# Altium schematic sheet connectors_and_power.SchDoc
size A4
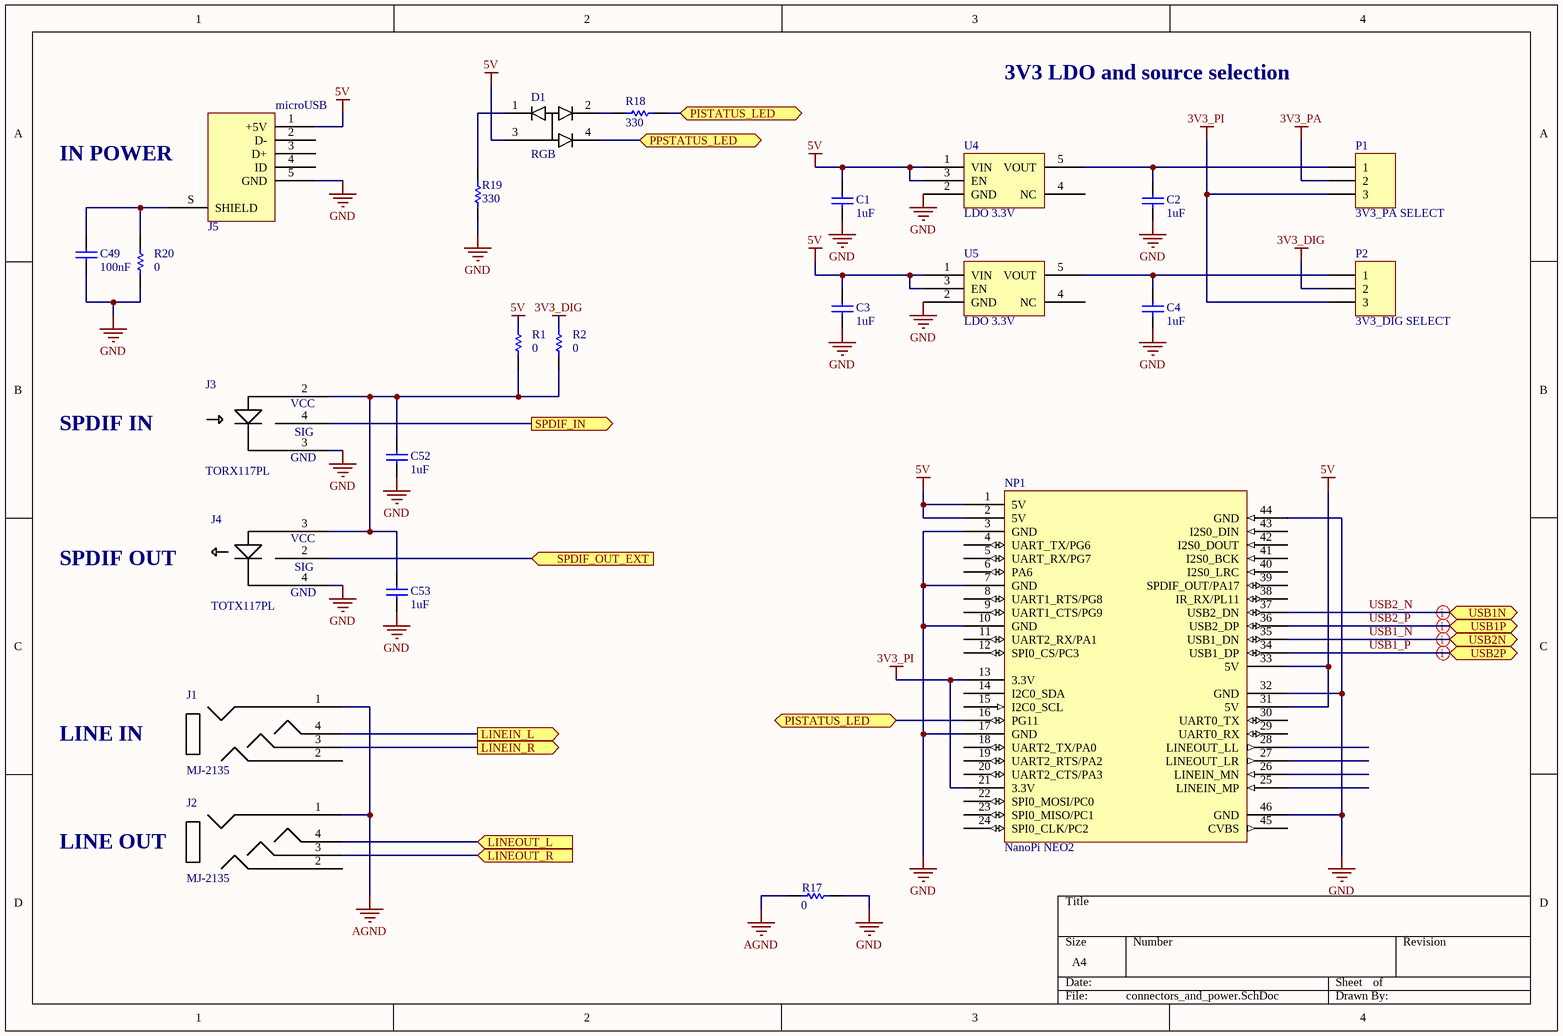
[diagram p0: connectors_and_power.SchDoc]

## Parts
C1  value 1uF  [C_0402]
C2  value 1uF  [C_0402]
C3  value 1uF  [C_0402]
C4  value 1uF  [C_0402]
C49  value 100nF  [C_0402]
C52  value 1uF  [C_0402]
C53  value 1uF  [C_0402]
D1  RGB  [RGB]
J1  MJ-2135  [audio jack]
J2  MJ-2135  [audio jack]
J3  TORX117PL  [TOXX177PL]
J4  TOTX117PL  [TOXX177PL]
J5  Micro USB Jack  [microUSB]  (value not drawn)
NP1  nanopi_neo2  [nanopi_neo2_dock]  (value not drawn)
P1  3V3_PA SELECT  [HDR1X3]
P2  3V3_DIG SELECT  [HDR1X3]
R1  value 0  [R_0402]  (hidden comment: Res1)
R2  value 0  [R_0402]  (hidden comment: Res1)
R17  value 0  [R_0402]  (hidden comment: Res1)
R18  Res1  [R_0402]  (value not drawn)
R19  Res1  [R_0402]  (value not drawn)
R20  value 0  [R_0402]  (hidden comment: Res1)
U4  LDO 3.3V  [SOT95P280X145-5N]
U5  LDO 3.3V  [SOT95P280X145-5N]

## Ports
LINEIN_L (out), LINEIN_R (out), LINEOUT_L (in), LINEOUT_R (in), PISTATUS_LED (bidir), PPSTATUS_LED (bidir), SPDIF_IN (out), SPDIF_OUT_EXT (in), USB1N (bidir), USB1P (bidir), USB2N (bidir), USB2P (bidir)

## Nets
3V3_DIG: P2.2 R2.2
3V3_PA: P1.2
3V3_PI: NP1.13(3.3V) NP1.21(3.3V) P1.3 P2.3
5V: C1.2 C3.2 D1.3(ANODE) J5.1(+5V) NP1.1(5V) NP1.2(5V) NP1.31(5V) NP1.33(5V) R1.2 U4.1(VIN) U4.3(EN) U5.1(VIN) U5.3(EN)
AGND: J1.1 J2.1 R17.2
GND: C1.1 C2.1 C3.1 C4.1 C49.1 C52.1 C53.1 J3.3(GND) J4.4(GND) J5.5(GND) NP1.3(GND) NP1.7(GND) NP1.10(GND) NP1.17(GND) NP1.32(GND) NP1.44(GND) NP1.46(GND) R17.1 R19.1 R20.1 U4.2(GND) U5.2(GND)
LINEIN_L: J1.4 ; port LINEIN_L
LINEIN_R: J1.3 ; port LINEIN_R
LINEOUT_L: J2.4 ; port LINEOUT_L
LINEOUT_R: J2.3 ; port LINEOUT_R
PISTATUS_LED: NP1.16(PG11) R18.1 ; port PISTATUS_LED
PPSTATUS_LED: D1.4(BLUE) ; port PPSTATUS_LED
SPDIF_IN: J3.4(SIG) ; port SPDIF_IN
SPDIF_OUT_EXT: J4.2(SIG) ; port SPDIF_OUT_EXT
USB1_N: NP1.35(USB1_DN) ; port USB2N
USB1_P: NP1.34(USB1_DP) ; port USB2P
USB2_N: NP1.37(USB2_DN) ; port USB1N
USB2_P: NP1.36(USB2_DP) ; port USB1P
NetC2_2: C2.2 P1.1 U4.5(VOUT)
NetC4_2: C4.2 P2.1 U5.5(VOUT)
NetC49_2: C49.2 J5.S(SHIELD) R20.2
NetC52_2: C52.2 C53.2 J3.2(VCC) J4.3(VCC) R1.1 R2.1
NetD1_1: D1.1(RED) R19.2
NetD1_2: D1.2(GREEN) R18.2

Not connected (* = marked no-connect by the designer): J1 2; J2 2; J5 2(D-) 3(D+) 4(ID); NP1 4(UART_TX/PG6) 5(UART_RX/PG7) 6(PA6) 8(UART1_RTS/PG8) 9(UART1_CTS/PG9) 11(UART2_RX/PA1) 12(SPI0_CS/PC3) 14(I2C0_SDA) 15(I2C0_SCL) 18(UART2_TX/PA0) 19(UART2_RTS/PA2) 20(UART2_CTS/PA3) 22(SPI0_MOSI/PC0) 23(SPI0_MISO/PC1) 24(SPI0_CLK/PC2) 25(LINEIN_MP) 26(LINEIN_MN) 27(LINEOUT_LR) 28(LINEOUT_LL) 29(UART0_RX) 30(UART0_TX) 38(IR_RX/PL11) 39(SPDIF_OUT/PA17) 40(I2S0_LRC) 41(I2S0_BCK) 42(I2S0_DOUT) 43(I2S0_DIN) 45(CVBS); U4 4(NC); U5 4(NC)

## Layout directives
differential pair: USB1_N, USB1_P, USB2_N, USB2_P

## Notes on the sheet
- 3V3 LDO and source selection
- IN POWER
- SPDIF IN
- SPDIF OUT
- LINE IN
- LINE OUT
- (in symbol Micro USB Jack) microUSB
- (in symbol nanopi_neo2) NanoPi NEO2
- (in symbol Res1) 330

## Library data of the parts
C1-C4 C49 C52 C53 = Cap
J1 J2 = MJ-2135: 3.5mm Audio jack
J5 = Micro USB Jack: Molex micro USB AB  47589-0001
NP1 = nanopi_neo2: Flipped NanoPi NEO2 dock
P1 P2 = Header 3: Header, 3-Pin; LatestRevisionDate: 17-Jul-2002; LatestRevisionNote: Re-released for DXP Platform.; Publisher: Altium Limited
R1 R2 R17-R20 = Res1: Resistor